# EAGLE design controller_rev1.1(flat) (EAGLE 8.6.3)

## Sheet 1 of 3
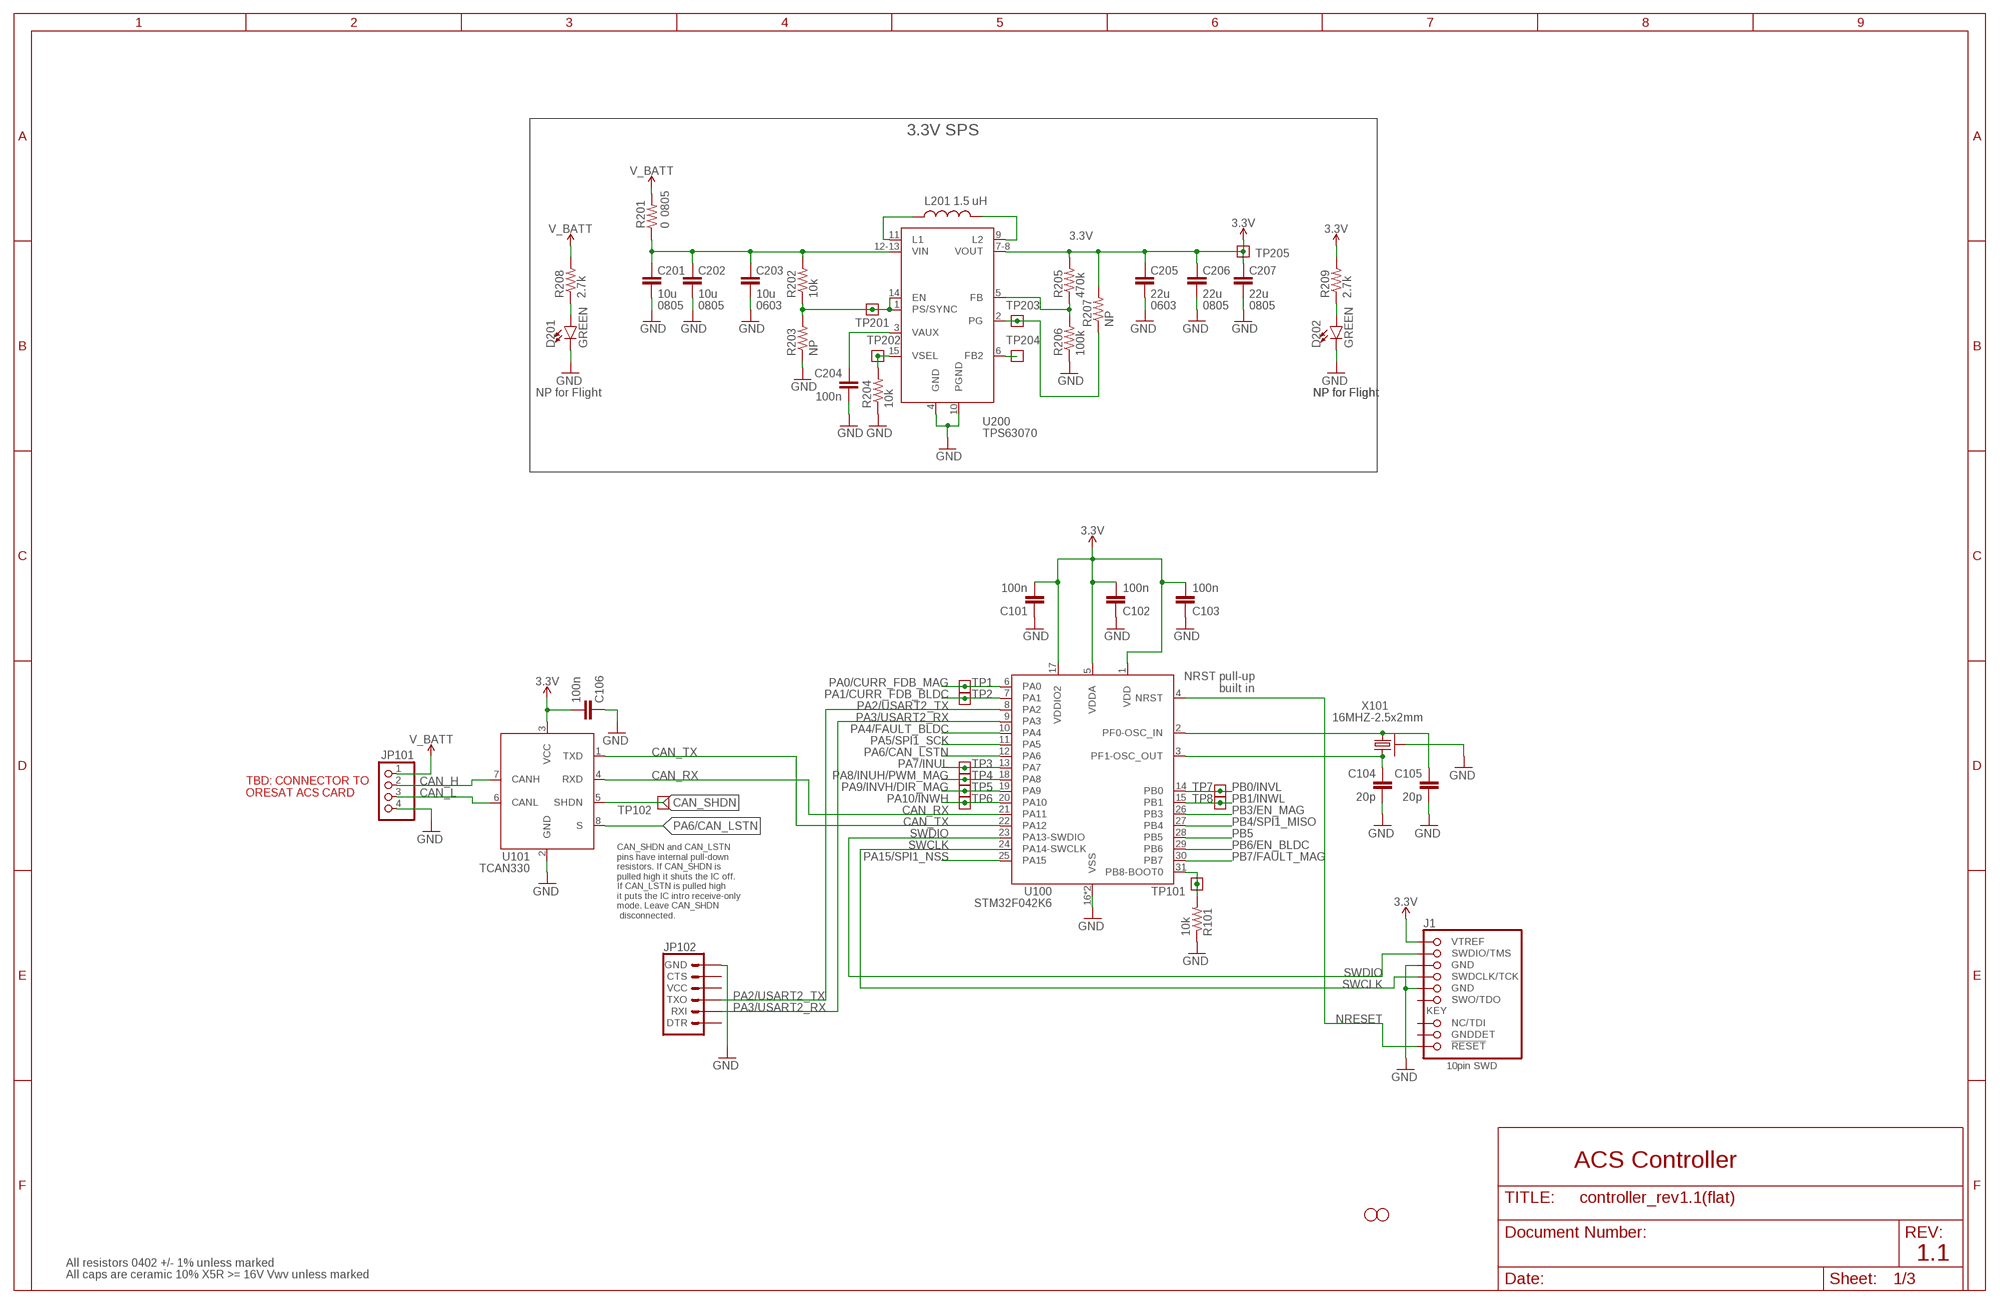
[diagram p0: schematic, sheet 1]

### Parts
C101  100n  C-EU0402-B-NOSILK  [.0402-B-NOSILK]
C102  100n  C-EU0402-B-NOSILK  [.0402-B-NOSILK]
C103  100n  C-EU0402-B-NOSILK  [.0402-B-NOSILK]
C104  20p  C-EU0402-B-NOSILK  [.0402-B-NOSILK]
C105  20p  C-EU0402-B-NOSILK  [.0402-B-NOSILK]
C106  100n  C-EU0402-B-NOSILK  [.0402-B-NOSILK]
C201  10u  C-EU0805-B-NOSILK  [.0805-B-NOSILK]
C202  10u  C-EU0805-B-NOSILK  [.0805-B-NOSILK]
C203  10u  C-EU0603-B-NOSILK  [.0603-B-NOSILK]
C204  100n  C-EU0402-B-NOSILK  [.0402-B-NOSILK]
C205  22u  C-EU0603-B-NOSILK  [.0603-B-NOSILK]
C206  22u  C-EU0805-B-NOSILK  [.0805-B-NOSILK]
C207  22u  C-EU0805-B-NOSILK  [.0805-B-NOSILK]
D201  GREEN  LED-GREEN0603  [LED-0603]
D202  GREEN  LED-GREEN0603  [LED-0603]
H1  STAND-OFFTIGHT  [STAND-OFF-TIGHT]
H2  STAND-OFFTIGHT  [STAND-OFF-TIGHT]
J1  1.27MM-SWD-CONNECTOR  [1.27MM_2X5]
JP101  PINHD-1X4  [1X04]
JP102  6_PIN_SERIAL_TARGETSILK  [6_PIN_SERIAL_TARGET_SIDE_W_SILK]
L201  1.5 uH  L-COILCRAFT-XFL4020  [L-COILCRAFT-XFL4020]
R101  10k  R-US_0402-B-NOSILK  [.0402-B-NOSILK]
R201  0  R-US_0805-B-NOSILK  [.0805-B-NOSILK]
R202  10k  R-US_0402-B-NOSILK  [.0402-B-NOSILK]
R203  NP  R-US_0402-B-NOSILK  [.0402-B-NOSILK]
R204  10k  R-US_0402-B-NOSILK  [.0402-B-NOSILK]
R205  470k  R-US_0402-B-NOSILK  [.0402-B-NOSILK]
R206  100k  R-US_0402-B-NOSILK  [.0402-B-NOSILK]
R207  NP  R-US_0402-B-NOSILK  [.0402-B-NOSILK]
R208  2.7k  R-US_0402-B-NOSILK  [.0402-B-NOSILK]
R209  2.7k  R-US_0402-B-NOSILK  [.0402-B-NOSILK]
TP1  TEST-POINT  [2MM-TEST-POINT]
TP2  TEST-POINT  [2MM-TEST-POINT]
TP3  TEST-POINT  [2MM-TEST-POINT]
TP4  TEST-POINT  [2MM-TEST-POINT]
TP5  TEST-POINT  [2MM-TEST-POINT]
TP6  TEST-POINT  [2MM-TEST-POINT]
TP7  TEST-POINT  [2MM-TEST-POINT]
TP8  TEST-POINT  [2MM-TEST-POINT]
TP101  TEST-POINT  [2MM-TEST-POINT]
TP102  TEST-POINT  [2MM-TEST-POINT]
TP201  TEST-POINT  [2MM-TEST-POINT]
TP202  TEST-POINT  [2MM-TEST-POINT]
TP203  TEST-POINT  [2MM-TEST-POINT]
TP204  TEST-POINT  [2MM-TEST-POINT]
TP205  TEST-POINT  [2MM-TEST-POINT]
U100  STM32F042K6  [QFP32-7X7]
U101  TCAN330  [SOT23-8_TI-DCN]
U200  TPS63070  TPS63070X  [TPS63070X]
X101  16MHZ-2.5x2mm  CRYSTAL-WITH-GND  [CRYSTAL_2.5X2]

### Nets
3.3V: C101.2 C102.2 C103.2 C106.2 C205.1 C206.1 C207.1 J1.VTREF R205.2 R207.2 R209.2 TP205.1 U100.1(VDD) U100.5(VDDA) U100.17(VDDIO2) U101.3(VCC) U200.7-8(VOUT) ; also sheet 2,3
BOOT: R101.2 TP101.1 U100.31(PB8-BOOT0)
CAN_H: JP101.2 U101.7(CANH)
CAN_L: JP101.3 U101.6(CANL)
CAN_RX: U100.21(PA11) U101.4(RXD)
CAN_SHDN: TP102.1 U101.5(SHDN)
CAN_TX: U100.22(PA12) U101.1(TXD)
CRYSTALIN: C105.1 U100.2(PF0-OSC_IN) X101.1
CRYSTALOUT: C104.1 U100.3(PF1-OSC_OUT) X101.3
GND: C101.1 C102.1 C103.1 C104.2 C105.2 C106.1 C201.2 C202.2 C203.2 C204.2 C205.2 C206.2 C207.2 D201.C D202.C J1.GND J1.GND@2(GND) JP101.4 JP102.P$6(GND) R101.1 R203.1 R204.1 R206.1 U100.16(VSS) U100.32(VSS) U101.2(GND) U200.4(GND) U200.10(PGND) X101.2(SHIELD) X101.4(SHIELD) ; also sheet 2,3
N$270: D201.A R208.1
N$271: D202.A R209.1
NRESET: J1.!RESET U100.4(NRST)
PA0/CURR_FDB_MAG: TP1.1 U100.6(PA0) ; also sheet 3
PA1/CURR_FDB_BLDC: TP2.1 U100.7(PA1) ; also sheet 2
PA2/USART2_TX: JP102.P$2(TXO) U100.8(PA2)
PA3/USART2_RX: JP102.P$3(RXI) U100.9(PA3)
PA4/FAULT_BLDC: U100.10(PA4) ; also sheet 2
PA5/SPI1_SCK: U100.11(PA5) ; also sheet 2
PA6/CAN_LSTN: U100.12(PA6) U101.8(S)
PA7/INUL: TP3.1 U100.13(PA7) ; also sheet 2
PA8/INUH/PWM_MAG: TP4.1 U100.18(PA8) ; also sheet 2,3
PA9/INVH/DIR_MAG: TP5.1 U100.19(PA9) ; also sheet 2,3
PA10/INWH: TP6.1 U100.20(PA10) ; also sheet 2
PA15/SPI1_NSS: U100.25(PA15) ; also sheet 2
PB0/INVL: TP7.1 U100.14(PB0) ; also sheet 2
PB1/INWL: TP8.1 U100.15(PB1) ; also sheet 2
PB3/EN_MAG: U100.26(PB3) ; also sheet 3
PB4/SPI1_MISO: U100.27(PB4) ; also sheet 2
PB5: U100.28(PB5)
PB6/EN_BLDC: U100.29(PB6) ; also sheet 2
PB7/FAULT_MAG: U100.30(PB7) ; also sheet 3
SWCLK: J1.SWDCLK(SWDCLK/TCK) U100.24(PA14-SWCLK)
SWDIO: J1.SWDIO(SWDIO/TMS) U100.23(PA13-SWDIO)
TPS-EN: R202.1 R203.2 TP201.1 U200.1(PS/SYNC) U200.14(EN)
TPS-FB: R205.1 R206.2 U200.5(FB)
TPS-FB2: TP204.1 U200.6(FB2)
TPS-L1: L201.1 U200.11(L1)
TPS-L2: L201.2 U200.9(L2)
TPS-PG: R207.1 TP203.1 U200.2(PG)
TPS-VAUX: C204.1 U200.3(VAUX)
TPS-VIN: C201.1 C202.1 C203.1 R201.1 R202.2 U200.12-13(VIN)
TPS-VSEL: R204.2 TP202.1 U200.15(VSEL)
V_BATT: JP101.1 R201.2 R208.2 ; also sheet 2,3
Unconnected: J1.GNDDET J1.NC(NC/TDI) J1.SWO(SWO/TDO) JP102.P$1(DTR) JP102.P$4(VCC) JP102.P$5(CTS)

### Notes on the sheet
- 3.3V SPS
- 0805
- 0805 | 0805 | 0603 | 0603 | 0805 | 0805
- NP for Flight | NP for Flight | NP for Flight
- NRST pull-up
  built in
- TBD: CONNECTOR TO 
  ORESAT ACS CARD
- CAN_SHDN and CAN_LSTN
  pins have internal pull-down
  resistors. If CAN_SHDN is 
  pulled high it shuts the IC off.
  If CAN_LSTN is pulled high
  it puts the IC intro receive-only
  mode. Leave CAN_SHDN
   disconnected.
- ACS Controller
- 1.1
- All resistors 0402 +/- 1% unless marked
- All caps are ceramic 10% X5R >= 16V Vwv unless marked

## Sheet 2 of 3
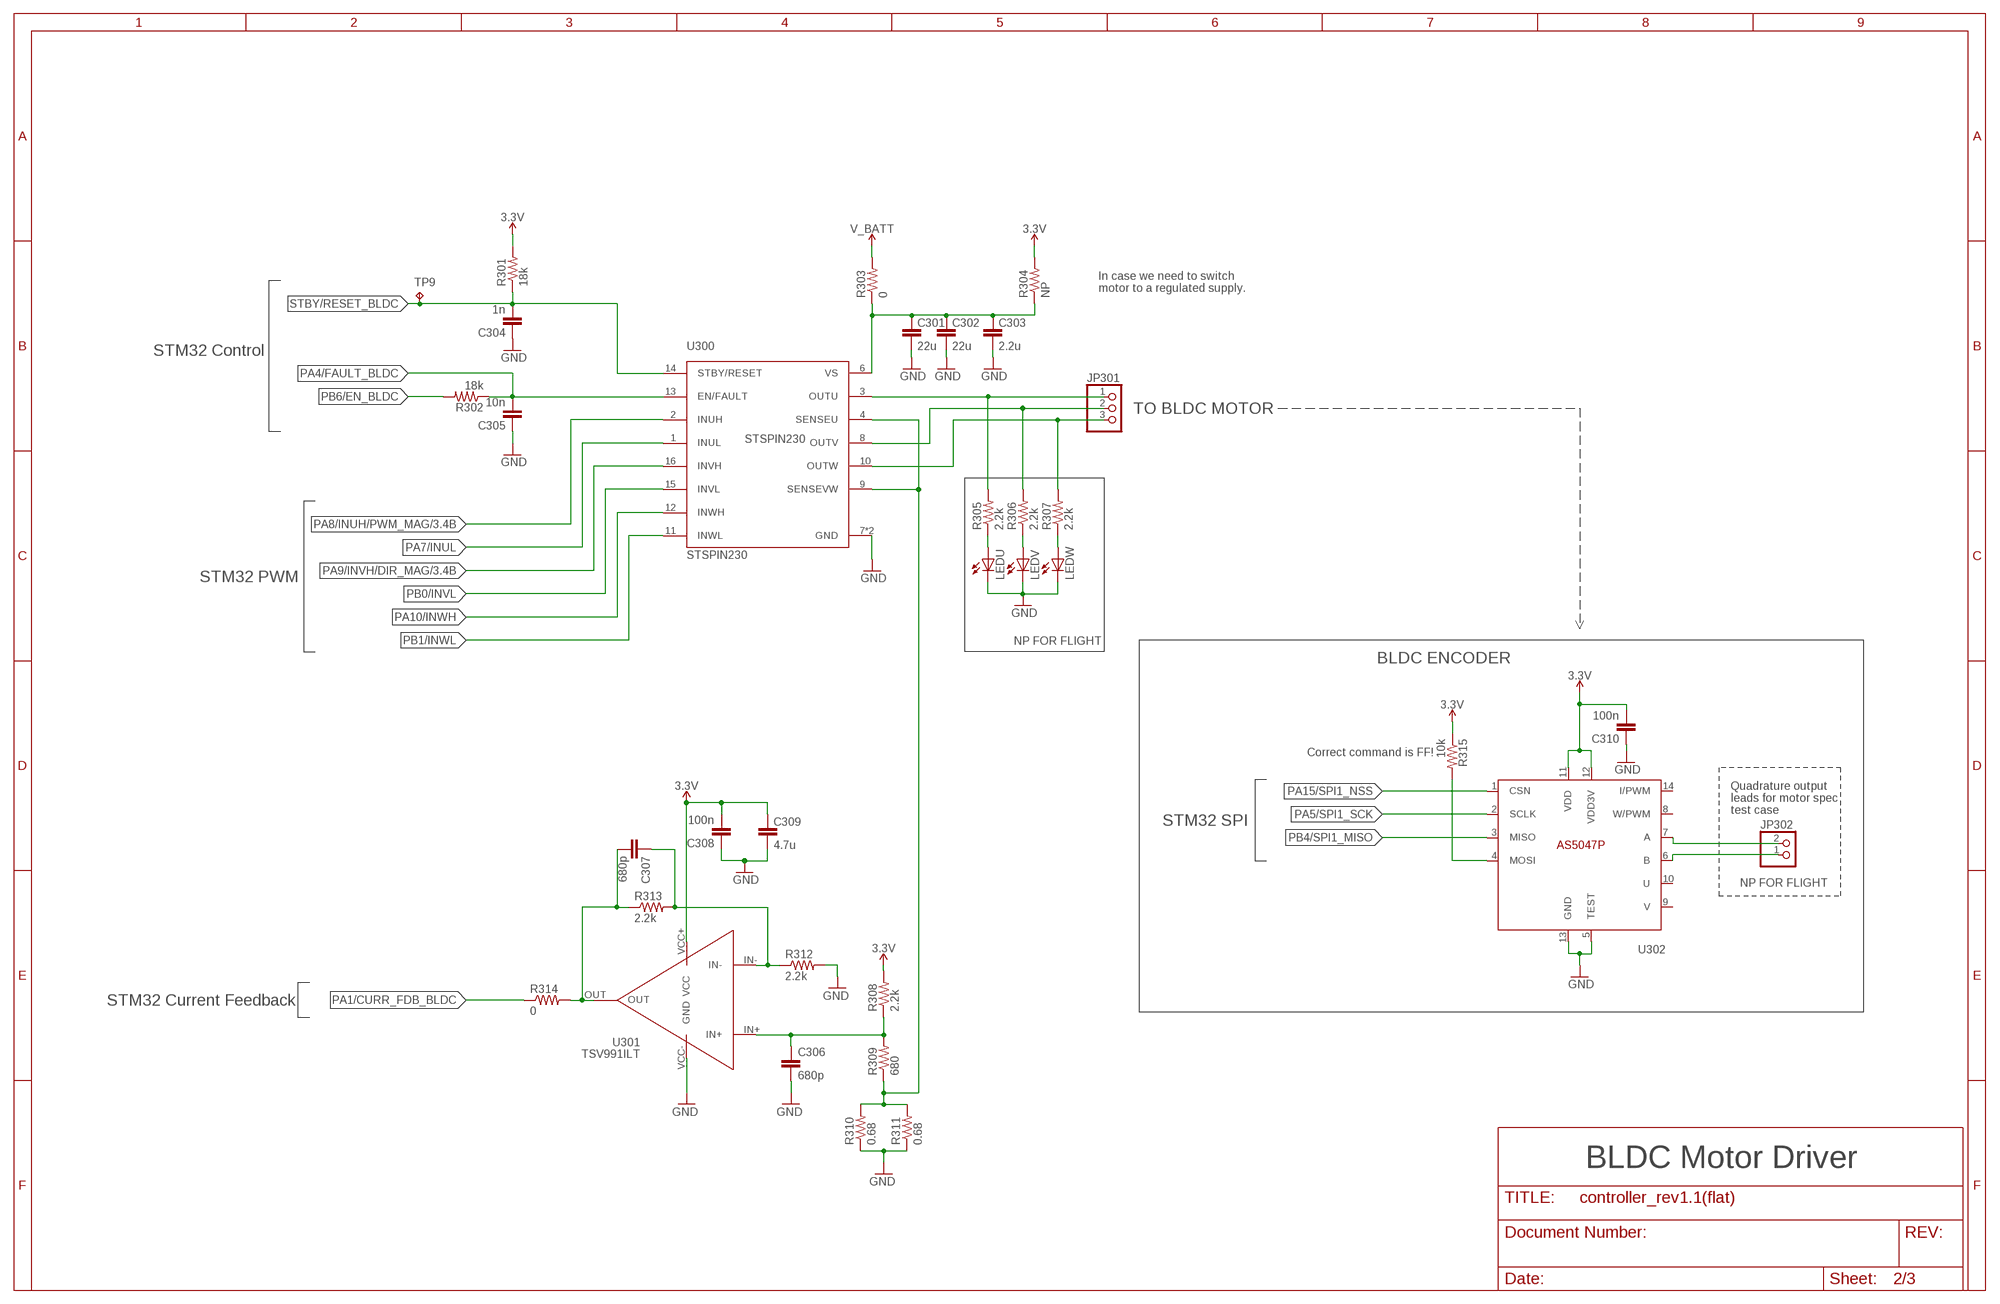
[diagram p1: schematic, sheet 2]

### Parts
C301  22u  C-EU0603-B-NOSILK  [.0603-B-NOSILK]
C302  22u  C-EU0603-B-NOSILK  [.0603-B-NOSILK]
C303  2.2u  C-EU0603-B-NOSILK  [.0603-B-NOSILK]
C304  1n  C-EU0402-B-NOSILK  [.0402-B-NOSILK]
C305  10n  C-EU0402-B-NOSILK  [.0402-B-NOSILK]
C306  680p  C-EU0402-B-NOSILK  [.0402-B-NOSILK]
C307  680p  C-EU0402-B-NOSILK  [.0402-B-NOSILK]
C308  100n  C-EU0402-B-NOSILK  [.0402-B-NOSILK]
C309  4.7u  C-EU0603-B-NOSILK  [.0603-B-NOSILK]
C310  100n  C-EU0402-B-NOSILK  [.0402-B-NOSILK]
JP301  PINHD-1X3  [1X03]
JP302  PINHD-1X2/90  [1X02/90]
LEDU  LEDCHIP-LED0603  [CHIP-LED0603]
LEDV  LEDCHIP-LED0603  [CHIP-LED0603]
LEDW  LEDCHIP-LED0603  [CHIP-LED0603]
R301  18k  R-US_0402-B-NOSILK  [.0402-B-NOSILK]
R302  18k  R-US_0402-B-NOSILK  [.0402-B-NOSILK]
R303  0  R-US_0805-B-NOSILK  [.0805-B-NOSILK]
R304  NP  R-US_0805-B-NOSILK  [.0805-B-NOSILK]
R305  2.2k  R-US_0805-B-NOSILK  [.0805-B-NOSILK]
R306  2.2k  R-US_0805-B-NOSILK  [.0805-B-NOSILK]
R307  2.2k  R-US_0805-B-NOSILK  [.0805-B-NOSILK]
R308  2.2k  R-US_0402-B-NOSILK  [.0402-B-NOSILK]
R309  680  R-US_0402-B-NOSILK  [.0402-B-NOSILK]
R310  0.68  R-US_0805-B-NOSILK  [.0805-B-NOSILK]
R311  0.68  R-US_0805-B-NOSILK  [.0805-B-NOSILK]
R312  2.2k  R-US_0402-B-NOSILK  [.0402-B-NOSILK]
R313  2.2k  R-US_0402-B-NOSILK  [.0402-B-NOSILK]
R314  0  R-US_0402-B-NOSILK  [.0402-B-NOSILK]
R315  10k  R-US_0402-B-NOSILK  [.0402-B-NOSILK]
TP9  TPPAD1-13  [P1-13]
U300  STSPIN230  [VFQFPN]
U301  TSV991ILT  [SOT23-5]
U302  AS5047P  [TSSOP14]

### Nets
3.3V: C308.2 C309.1 C310.2 R301.2 R304.2 R308.2 R315.1 U301.VCC+(VCC) U302.11(VDD) U302.12(VDD3V) ; also sheet 1,3
GND: C301.2 C302.2 C303.2 C304.1 C305.1 C306.2 C308.1 C309.2 C310.1 LEDU.C LEDV.C LEDW.C R310.1 R311.1 R312.2 U300.7(GND) U300.EPAD(GND) U301.VCC-(GND) U302.5(TEST) U302.13(GND) ; also sheet 1,3
N$1: R315.2 U302.4(MOSI)
N$4: JP302.2 U302.7(A)
N$6: LEDU.A R305.1
N$10: LEDV.A R306.1
N$11: LEDW.A R307.1
N$12: C301.1 C302.1 C303.1 R303.1 R304.1 U300.6(VS)
N$13: JP302.1 U302.6(B)
N$14: C307.1 R312.1 R313.2 U301.IN-
N$16: C306.1 R308.1 R309.2 U301.IN+
N$29: C307.2 R313.1 R314.2 U301.OUT
PA1/CURR_FDB_BLDC: R314.1 ; also sheet 1
PA4/FAULT_BLDC: C305.2 R302.1 U300.13(EN/FAULT) ; also sheet 1
PA5/SPI1_SCK: U302.2(SCLK) ; also sheet 1
PA7/INUL: U300.1(INUL) ; also sheet 1
PA8/INUH/PWM_MAG: U300.2(INUH) ; also sheet 1,3
PA9/INVH/DIR_MAG: U300.16(INVH) ; also sheet 1,3
PA10/INWH: U300.12(INWH) ; also sheet 1
PA15/SPI1_NSS: U302.1(CSN) ; also sheet 1
PB0/INVL: U300.15(INVL) ; also sheet 1
PB1/INWL: U300.11(INWL) ; also sheet 1
PB4/SPI1_MISO: U302.3(MISO) ; also sheet 1
PB6/EN_BLDC: R302.2 ; also sheet 1
SENSE_BLDC: R309.1 R310.2 R311.2 U300.4(SENSEU) U300.9(SENSEVW)
STBY/RESET_BLDC: C304.2 R301.1 TP9.TP U300.14(STBY/RESET)
U: JP301.1 R305.2 U300.3(OUTU)
V: JP301.2 R306.2 U300.8(OUTV)
V_BATT: R303.2 ; also sheet 1,3
W: JP301.3 R307.2 U300.10(OUTW)
Unconnected: U302.8(W/PWM) U302.9(V) U302.10(U) U302.14(I/PWM)

### Notes on the sheet
- In case we need to switch 
  motor to a regulated supply.
- STM32 Control
- TO BLDC MOTOR
- STM32 PWM
- NP FOR FLIGHT
- BLDC ENCODER
- Correct command is FF!
- Quadrature output
  leads for motor spec
  test case
- STM32 SPI
- NP FOR FLIGHT
- STM32 Current Feedback
- BLDC Motor Driver

## Sheet 3 of 3
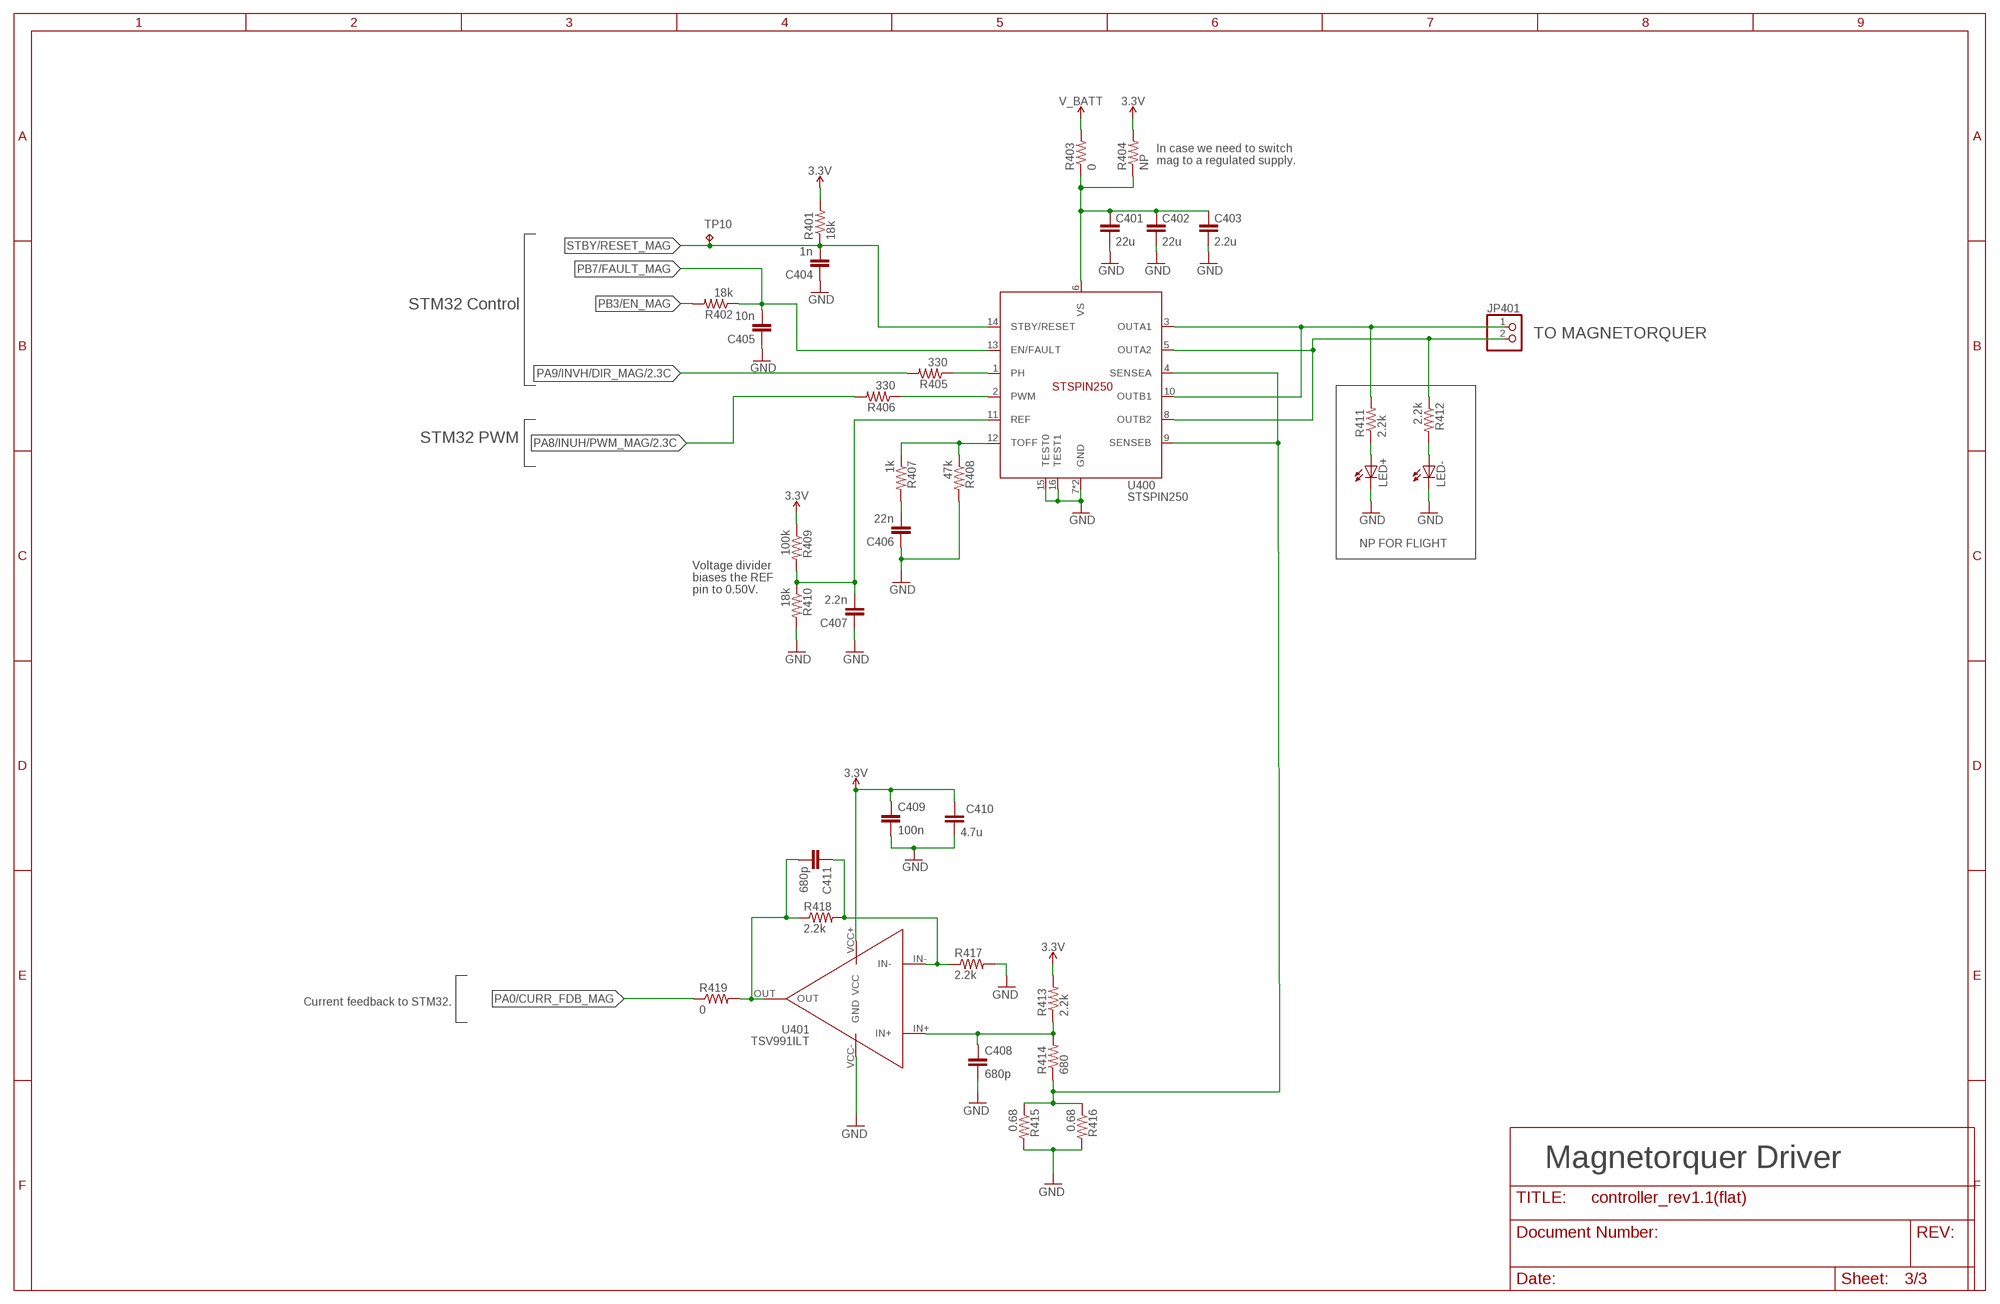
[diagram p2: schematic, sheet 3]

### Parts
C401  22u  C-EU0603-B-NOSILK  [.0603-B-NOSILK]
C402  22u  C-EU0603-B-NOSILK  [.0603-B-NOSILK]
C403  2.2u  C-EU0603-B-NOSILK  [.0603-B-NOSILK]
C404  1n  C-EU0402-B-NOSILK  [.0402-B-NOSILK]
C405  10n  C-EU0402-B-NOSILK  [.0402-B-NOSILK]
C406  22n  C-EU0402-B-NOSILK  [.0402-B-NOSILK]
C407  2.2n  C-EU0402-B-NOSILK  [.0402-B-NOSILK]
C408  680p  C-EU0402-B-NOSILK  [.0402-B-NOSILK]
C409  100n  C-EU0402-B-NOSILK  [.0402-B-NOSILK]
C410  4.7u  C-EU0603-B-NOSILK  [.0603-B-NOSILK]
C411  680p  C-EU0402-B-NOSILK  [.0402-B-NOSILK]
JP401  PINHD-1X2  [1X02]
LED+  LEDCHIP-LED0603  [CHIP-LED0603]
LED-  LEDCHIP-LED0603  [CHIP-LED0603]
R401  18k  R-US_0402-B-NOSILK  [.0402-B-NOSILK]
R402  18k  R-US_0402-B-NOSILK  [.0402-B-NOSILK]
R403  0  R-US_0805-B-NOSILK  [.0805-B-NOSILK]
R404  NP  R-US_0805-B-NOSILK  [.0805-B-NOSILK]
R405  330  R-US_0402-B-NOSILK  [.0402-B-NOSILK]
R406  330  R-US_0402-B-NOSILK  [.0402-B-NOSILK]
R407  1k  R-US_0402-B-NOSILK  [.0402-B-NOSILK]
R408  47k  R-US_0402-B-NOSILK  [.0402-B-NOSILK]
R409  100k  R-US_0402-B-NOSILK  [.0402-B-NOSILK]
R410  18k  R-US_0402-B-NOSILK  [.0402-B-NOSILK]
R411  2.2k  R-US_0805-B-NOSILK  [.0805-B-NOSILK]
R412  2.2k  R-US_0805-B-NOSILK  [.0805-B-NOSILK]
R413  2.2k  R-US_0402-B-NOSILK  [.0402-B-NOSILK]
R414  680  R-US_0402-B-NOSILK  [.0402-B-NOSILK]
R415  0.68  R-US_0805-B-NOSILK  [.0805-B-NOSILK]
R416  0.68  R-US_0805-B-NOSILK  [.0805-B-NOSILK]
R417  2.2k  R-US_0402-B-NOSILK  [.0402-B-NOSILK]
R418  2.2k  R-US_0402-B-NOSILK  [.0402-B-NOSILK]
R419  0  R-US_0402-B-NOSILK  [.0402-B-NOSILK]
TP10  TPPAD1-13  [P1-13]
U400  STSPIN250  [VFQPN]
U401  TSV991ILT  [SOT23-5]

### Nets
3.3V: C409.1 C410.1 R401.2 R404.2 R409.1 R413.2 U401.VCC+(VCC) ; also sheet 1,2
GND: C401.2 C402.2 C403.2 C404.1 C405.1 C406.1 C407.1 C408.2 C409.2 C410.2 LED+.C LED-.C R408.2 R410.2 R415.2 R416.2 R417.2 U400.7(GND) U400.15(TEST0) U400.16(TEST1) U400.EPAD(GND) U401.VCC-(GND) ; also sheet 1,2
N$2: C406.2 R407.2
N$3: R406.1 U400.2(PWM)
N$5: R405.1 U400.1(PH)
N$15: C408.1 R413.1 R414.2 U401.IN+
N$17: C411.1 R417.1 R418.2 U401.IN-
N$19: R407.1 R408.1 U400.12(TOFF)
N$20: C401.1 C402.1 C403.1 R403.1 R404.1 U400.6(VS)
N$22: LED+.A R411.1
N$23: LED-.A R412.2
N$25: C407.2 R409.2 R410.1 U400.11(REF)
N$27: C411.2 R418.1 R419.2 U401.OUT
OUT1: JP401.1 R411.2 U400.3(OUTA1) U400.10(OUTB1)
OUT2: JP401.2 R412.1 U400.5(OUTA2) U400.8(OUTB2)
PA0/CURR_FDB_MAG: R419.1 ; also sheet 1
PA8/INUH/PWM_MAG: R406.2 ; also sheet 1,2
PA9/INVH/DIR_MAG: R405.2 ; also sheet 1,2
PB3/EN_MAG: R402.2 ; also sheet 1
PB7/FAULT_MAG: C405.2 R402.1 U400.13(EN/FAULT) ; also sheet 1
SENSE_MAG: R414.1 R415.1 R416.1 U400.4(SENSEA) U400.9(SENSEB)
STBY/RESET_MAG: C404.2 R401.1 TP10.TP U400.14(STBY/RESET)
V_BATT: R403.2 ; also sheet 1,2

### Notes on the sheet
- In case we need to switch 
  mag to a regulated supply.
- STM32 Control
- TO MAGNETORQUER
- STM32 PWM
- NP FOR FLIGHT
- Voltage divider
  biases the REF
  pin to 0.50V.
- Current feedback to STM32.
- Magnetorquer Driver

## Library data of the parts
C101-C103 C106 C204 C304-C308 C310 C404-C409 C411 = rcl_custom:C-EU: CAPACITOR, European symbol; DIS: Digi-Key; DPN: 1276-1001-1-ND; MFR: Samsung; MPN: CL05B104KO5NNNC
C104 C105 = rcl_custom:C-EU: CAPACITOR, European symbol; DIS: Digi-Key; DPN: 1276-6601-1-ND; MFR: Samsung; MPN: CL05C200JB51PNC
C201 C202 C206 C207 = oresat-rcl:C-EU: CAPACITOR, European symbol
C203 C205 C301-C303 C309 C401-C403 C410 = oresat-rcl:C-EU: CAPACITOR, European symbol; DIS: Digi-Key; DPN: 1276-1001-1-ND; MFR: Samsung; MPN: CL05B104KO5NNNC
D201 D202 = SparkFun-LED:LED-GREEN: Green SMD LED Used in manufacturing of various products at SparkFun Packages: 0603 - SMD 0603 package [Product Link] <http://www.futureelectronics.com/en/technologies/semiconductors/optoelectronics/leds/Pages/9894312-LTST-C190GKT.aspx?CrossPart=HSMG-C190&IM=0> LilyPad 1206 - SMD1206 LilyPad package [Product Link] <http://www.futureelectronics.com/en/Technologies/Product.aspx?ProductID=IN150NGHARVATEKCORPORATION2049943&IM=0> 1206 - SMD1206 package [Product Link] <http://www.futureelectronics.com/en/technologies/semiconductors/optoelectronics/leds/Pages/8315665-LTST-C150KGKT.aspx?IM=0> 1206 Bottom Mount -SMD 1206 Bottom Mount [Product Link] <http://www.digikey.com/product-detail/en/lite-on-inc/LTST-C230KGKT/160-1456-1-ND/386854> SparkFun Products: Pro Mini 328 -5V <https://www.sparkfun.com/products/821> RedBoard <https://www.sparkfun.com/products/12757> MP3 Trigger <https://www.sparkfun.com/products/13720> Makey Makey <https://www.sparkfun.com/products/11076>; PROD_ID: DIO-00821
H1 H2 = SparkFun-Hardware:STAND-OFF: Stand Off Drill holes for mechanically mounting via screws, standoffs, etc. Note: Use the keepout ring to avoid running the screw head into surrounding components. Variant Overviews STAND-OFF - Mechanical footprint for a #4 phillips button head screw. STAND-OFF-TIGHT - Mechanical footprint for a #4 phillips button head screw, Example SparkFun Products Screw - Phillips Head (1/4", 4-40, 10 pack) <https://www.sparkfun.com/products/10453> (PRT-10453) Screw - Phillips Head (1/2", 4-40, 10 pack) <https://www.sparkfun.com/products/10452> (PRT-10452) Screw - Phillips Head (3/4", 4-40, 10 pack) <https://www.sparkfun.com/products/10451> (PRT-10451) Screw - Phillips Head (1", 4-40, 10 pack) <https://www.sparkfun.com/products/10450> (PRT-10450)
J1 = J-CNC-3220-10-0100-00-ARM-SWD-port:1.27MM-SWD-CONNECTOR: ARM SWD Programming Header. Example part is the CNC 3220-10-0100-00
JP101 = pinhead:PINHD-1X4: PIN HEADER
JP102 = SparkFun-Connectors:6_PIN_SERIAL_TARGET: 6-pin header connection for use with the "FTDI BASIC" pinout - TARGET SIDE. Also known as "Arduino Serial Program Header". It is used to mate with our FTDI Basic serial programmers using the Arduino IDE. Note, this device has "TARGET" in the name. It is intended to be used on a design that contains a target micro-controller that you wish to program. The "sister" device, named "CABLE" is inteneded to be used on a design that usually lives on the end of your USB cable and prvides the converter chip (FTDI232 or FTDI231x) to commnicate serial RX/TX. You can populate with some of these: Break Away Headers - Straight <https://www.sparkfun.com/products/116> (PRT-00116) For reference (or to suit your programming needs) check out these designs: SparkFun FTDI Basic Breakout - 5V <https://www.sparkfun.com/products/9716> (DEV-09716) SparkFun FTDI Basic Breakout - 3.3V <https://www.sparkfun.com/products/9873> (DEV-09873) SparkFun FTDI SmartBasic <https://www.sparkfun.com/products/12935> (DEV-12935) SparkFun Beefy 3 - FTDI Basic Breakout <https://www.sparkfun.com/products/13746> (DEV-13746)
JP301 = pinhead:PINHD-1X3: PIN HEADER
JP302 JP401 = pinhead:PINHD-1X2: PIN HEADER
L201 = L-Coilcraft-XFL4020:L-COILCRAFT-XFL4020; DIS: Mouser; DPN: 994-XFL4020-152MEB; MFR: Coilcraft; MPN: XFL4020-152ME
LED+ LED- LEDU LEDV LEDW = adafruit:LED: LED OSRAM: - CHIPLED LG R971, LG N971, LY N971, LG Q971, LY Q971, LO R971, LY R971 LH N974, LH R974 LS Q976, LO Q976, LY Q976 LO Q996 - Hyper CHIPLED LW Q18S LB Q993, LB Q99A, LB R99A - SideLED LS A670, LO A670, LY A670, LG A670, LP A670 LB A673, LV A673, LT A673, LW A673 LH A674 LY A675 LS A676, LA A676, LO A676, LY A676, LW A676 LS A679, LY A679, LG A679 - Hyper Micro SIDELED® LS Y876, LA Y876, LO Y876, LY Y876 LT Y87S - SmartLED LW L88C, LW L88S LB L89C, LB L89S, LG L890 LS L89K, LO L89K, LY L89K LS L896, LA L896, LO L896, LY L896 - TOPLED LS T670, LO T670, LY T670, LG T670, LP T670 LSG T670, LSP T670, LSY T670, LOP T670, LYG T670 LG T671, LOG T671, LSG T671 LB T673, LV T673, LT T673, LW T673 LH T674 LS T676, LA T676, LO T676, LY T676, LB T676, LH T676, LSB T676, LW T676 LB T67C, LV T67C, LT T67C, LS T67K, LO T67K, LY T67K, LW E67C LS E67B, LA E67B, LO E67B, LY E67B, LB E67C, LV E67C, LT E67C LW T67C LS T679, LY T679, LG T679 LS T770, LO T770, LY T770, LG T770, LP T770 LB T773, LV T773, LT T773, LW T773 LH T774 LS E675, LA E675, LY E675, LS T675 LS T776, LA T776, LO T776, LY T776, LB T776 LHGB T686 LT T68C, LB T68C - Hyper Mini TOPLED® LB M676 - Mini TOPLED Santana® LG M470 LS M47K, LO M47K, LY M47K Source: http://www.osram.convergy.de/
R101 R202-R209 R301 R302 R308 R309 R312-R315 R401 R402 R405-R410 R413 R414 R417-R419 = rcl_custom:R-US_: RESISTOR, American symbol; DIS: Digi-Key; DPN: 1276-4275-1-ND; MFR: Samsung; MPN: RC1005F6653CS
R201 = rcl_custom:R-US_: RESISTOR, American symbol; DIS: Digi-Key; DPN: RHM0.0ARCT-ND; MFR: Rohm; MPN: MCR10EZPJ000
R303-R307 R310 R311 R403 R404 R411 R412 R415 R416 = oresat-rcl:R-US_: RESISTOR, American symbol
TP1-TP8 TP101 TP102 TP201-TP205 = Tova:TEST-POINT
TP9 TP10 = testpad:TP: Test pad
U100 = STM32F042K:STM32F042K6; DIS: Digi-Key; DPN: STM32F042K6T7-ND; MFR: STMicroelectronics; MPN: STM32F042K6T7
U101 = TCAN330:TCAN330; DIS: Digi-Key; DPN: 296-44211-1-ND; MFR: Texas Instruments; MPN: TCAN330GDCNT
U200 = ic-pwr-tps63070x:TPS63070X: TPS63070 2-V to 16-V Buck-Boost Converter With 3.6-A Switch Current
U300 = U-ST-STSPIN230-BLDC-controller:STSPIN230
U301 U401 = TSV991ILT:TSV991ILT
U302 = U-AMS-AS5047P-encoder:AS5047P
U400 = U-ST-STSPIN250-Brushed-DC-controller:STSPIN250
X101 = low-gain-radio:CRYSTAL-WITH-GND; DIS: Digi-Key; DPN: XC2181CT-ND; MFR: ECS Inc.; MPN: ECS-160-10-36Q-ES-TR

## Board
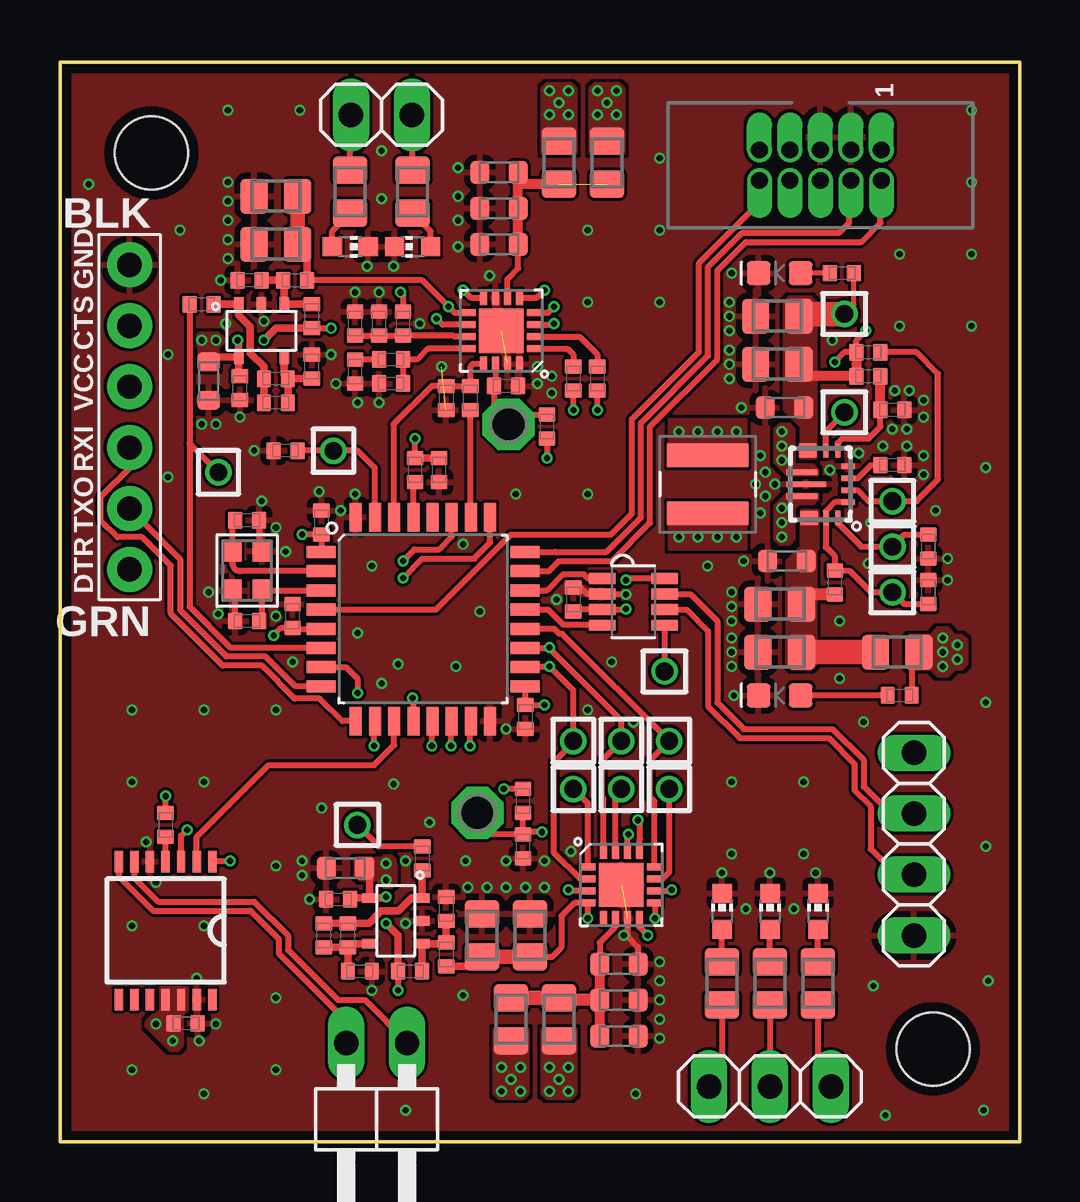
[diagram p3: board, top side]
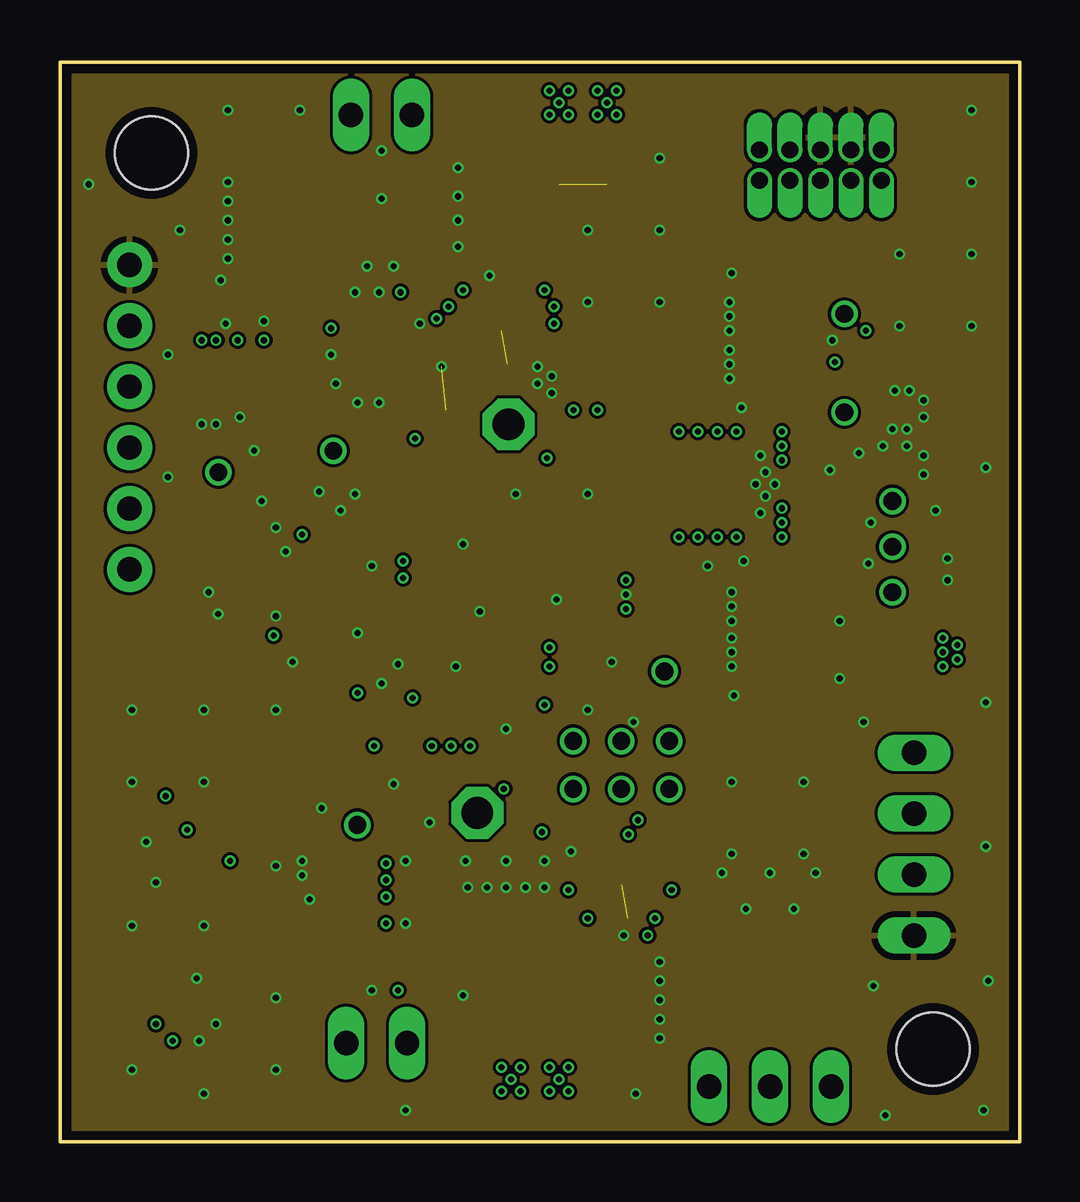
[diagram p4: board, inner layer Route2]
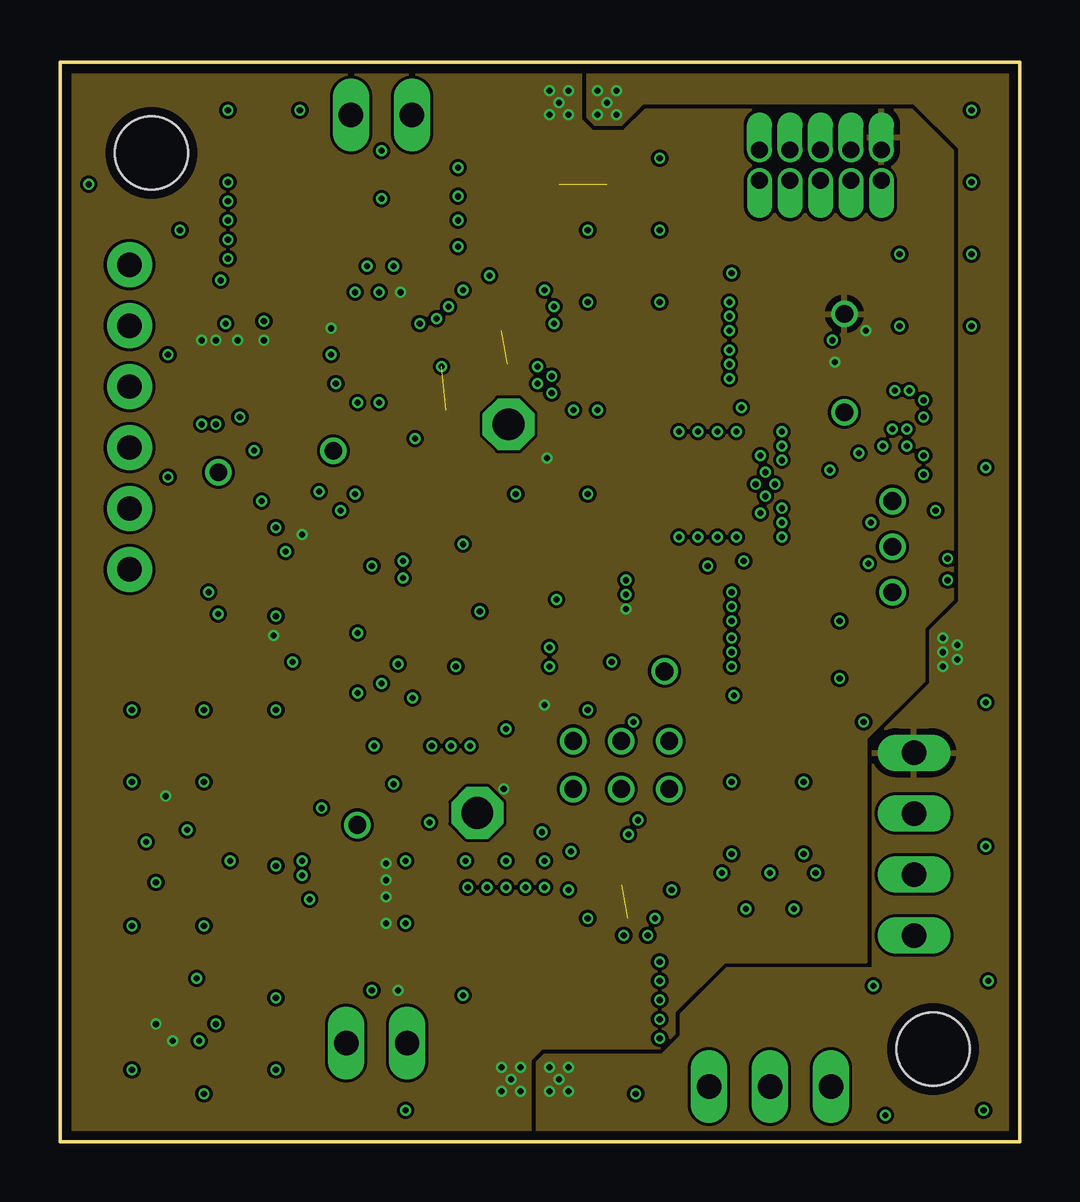
[diagram p5: board, inner layer Route15]
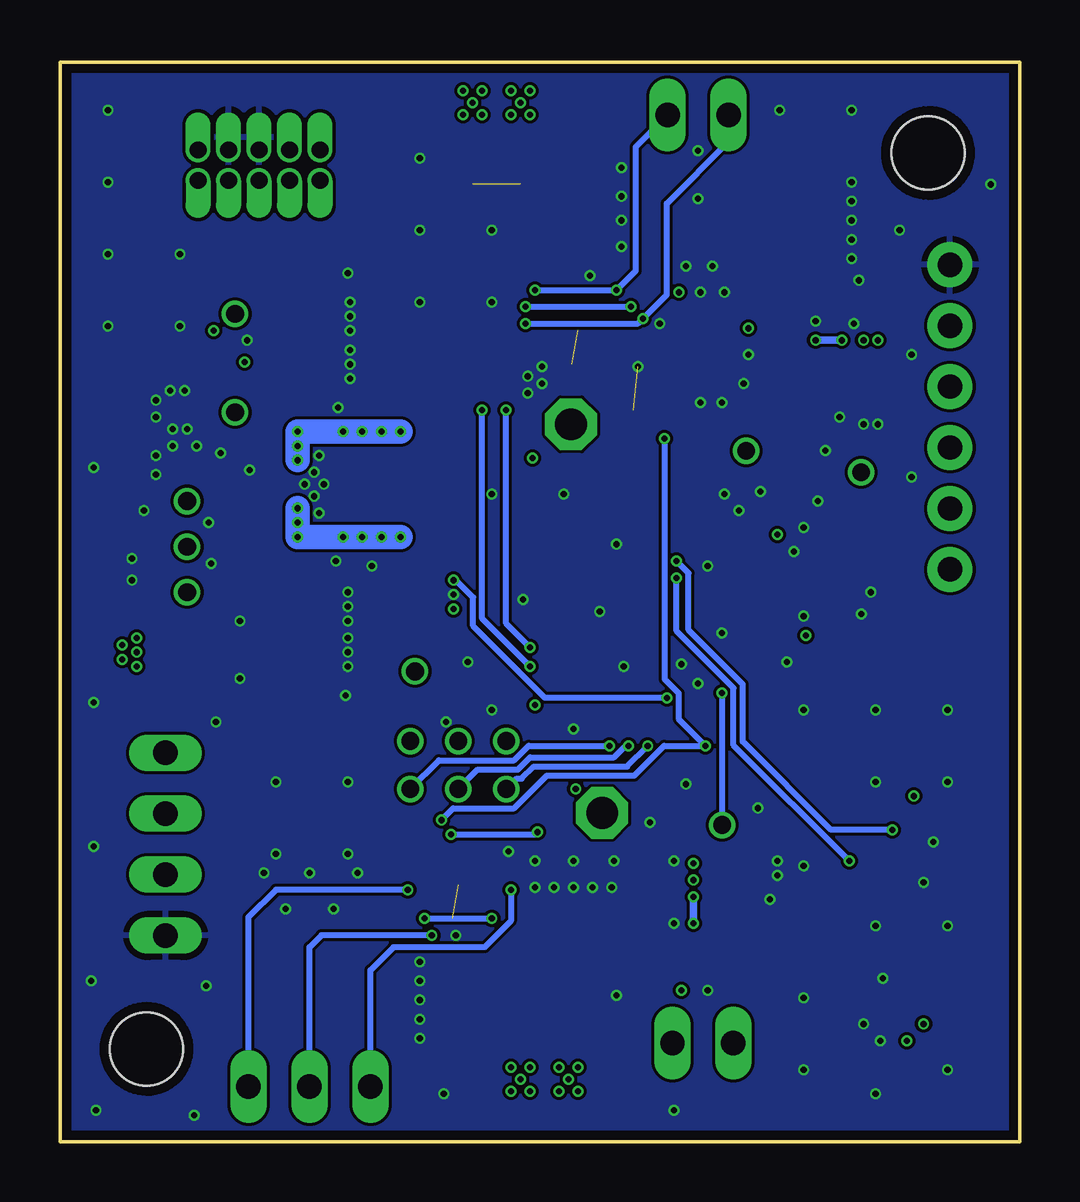
[diagram p6: board, bottom side, seen from below]

Size 40 x 45 mm. Coordinates in mm from the lower left corner, seen from the top.
Outline: 0,0 40,0 40,45 0,45 0,0
Copper layers (1*2*15*16): Top 0.035559375mm / dielectric 0.17018125mm / Route2 0.01778125mm / dielectric 47mil / Route15 0.01778125mm / dielectric 0.17018125mm / Bottom 0.035559375mm
Design rules "oshpark-4layer-tented": minimum track width 5mil, minimum drill 10mil, track to track 5mil, track to pad 5mil, pad to pad 5mil, via to via 5mil, smd to smd 5mil, copper to edge 15mil, drill to drill 6mil, minimum pad ring 4mil, minimum via ring 4mil, stop-mask expansion 2.5mil, vias tented up to drill 20mil, thermal gap 10mil

### Footprints (pad centres in the part's own frame; a part is rotated, then mirrored left to right if it is on the bottom)
.0402-B-NOSILK = smd 0.6 x 0.7: 1 -0.5,0; 2 0.5,0
.0805-B-NOSILK = smd 1.15 x 1.45: 1 -0.9,0; 2 0.9,0
.0603-B-NOSILK = smd 0.8 x 0.95: 1 -0.8,0; 2 0.8,0
LED-0603 = smd 1 x 1: A -0.877,0; C 0.877,0
STAND-OFF-TIGHT = hole 3.048: 0,0
1.27MM_2X5 = drill 0.7 pad 1.016 offset: !RESET 0.635,-2.54; GND -0.635,1.27; GND@2 -0.635,0; GNDDET -0.635,-2.54; KEY -0.635,-1.27; NC 0.635,-1.27; SWDCLK 0.635,1.27; SWDIO 0.635,2.54; SWO 0.635,0; VTREF -0.635,2.54
1X04 = drill 1.016 long: 1 -3.81,0; 2 -1.27,0; 3 1.27,0; 4 3.81,0
6_PIN_SERIAL_TARGET_SIDE_W_SILK = drill 1.016 pad 1.88: P$1 -6.35,0; P$2 -3.81,0; P$3 -1.27,0; P$4 1.27,0; P$5 3.81,0; P$6 6.35,0
1X03 = drill 1.016 long: 1 -2.54,0; 2 0,0; 3 2.54,0
1X02/90 = drill 1.016 long: 1 -1.27,-3.81; 2 1.27,-3.81
1X02 = drill 1.016 long: 1 -1.27,0; 2 1.27,0
L-COILCRAFT-XFL4020 = smd 0.98 x 3.4: 1 -1.2,0; 2 1.2,0
CHIP-LED0603 = smd 0.8 x 0.8: A 0,-0.75; C 0,0.75
2MM-TEST-POINT = drill 0.737: 1 0,0
P1-13 = drill 1.321 pad 2.159 octagon: TP 0,0
QFP32-7X7 = smd 1.2 x 0.5: 1 -4.25,2.8; 2 -4.25,2; 3 -4.25,1.2; 4 -4.25,0.4; 5 -4.25,-0.4; 6 -4.25,-1.2; 7 -4.25,-2; 8 -4.25,-2.8; 17 4.25,-2.8; 18 4.25,-2; 19 4.25,-1.2; 20 4.25,-0.4; 21 4.25,0.4; 22 4.25,1.2; 23 4.25,2; 24 4.25,2.8 | smd 0.5 x 1.2: 9 -2.8,-4.25; 10 -2,-4.25; 11 -1.2,-4.25; 12 -0.4,-4.25; 13 0.4,-4.25; 14 1.2,-4.25; 15 2,-4.25; 16 2.8,-4.25; 25 2.8,4.25; 26 2,4.25; 27 1.2,4.25; 28 0.4,4.25; 29 -0.4,4.25; 30 -1.2,4.25; 31 -2,4.25; 32 -2.8,4.25
SOT23-8_TI-DCN = smd 0.45 x 1.1: 1 -0.975,-1.3; 2 -0.325,-1.3; 3 0.325,-1.3; 4 0.975,-1.3; 5 0.975,1.3; 6 0.325,1.3; 7 -0.325,1.3; 8 -0.975,1.3
TPS63070X = smd 0.6 x 0.25: 1 -1.15,0.75; 2 -1.15,0.25; 3 -1.15,-0.25; 4 -1.15,-0.75 | smd 0.25 x 0.6: 5 -0.725,-1.4; 6 -0.225,-1.4; 14 -0.225,1.4; 15 -0.725,1.4 | smd 0.75 x 0.6: 7-8 0.525,-1.4; 12-13 0.475,1.4 | smd 1.35 x 0.25: 9 0.775,-0.5; 11 0.775,0.5 | smd 1.7 x 0.25: 10 0.6,0
VFQFPN = smd 0.63 x 0.3: 1 -1.39,0.75; 2 -1.39,0.25; 3 -1.39,-0.25; 4 -1.39,-0.75; 9 1.39,-0.75; 10 1.39,-0.25; 11 1.39,0.25; 12 1.39,0.75 | smd 0.3 x 0.63: 5 -0.75,-1.39; 6 -0.25,-1.39; 7 0.25,-1.39; 8 0.75,-1.39; 13 0.75,1.39; 14 0.25,1.39; 15 -0.25,1.39; 16 -0.75,1.39 | smd 1.85 x 1.85: EPAD 0,0
SOT23-5 = smd 0.4 x 0.6: IN+ 0.95,1.1; IN- 0.95,-1.1; OUT -0.95,1.1; VCC+ -0.95,-1.1; VCC- 0,1.1
TSSOP14 = smd 0.9 x 0.35: 1 -2.875,1.95; 2 -2.875,1.3; 3 -2.875,0.65; 4 -2.875,0; 5 -2.875,-0.65; 6 -2.875,-1.3; 7 -2.875,-1.95; 8 2.875,-1.95; 9 2.875,-1.3; 10 2.875,-0.65; 11 2.875,0; 12 2.875,0.65; 13 2.875,1.3; 14 2.875,1.95
VFQPN = smd 0.63 x 0.3: 1 -1.39,0.75; 2 -1.39,0.25; 3 -1.39,-0.25; 4 -1.39,-0.75; 9 1.39,-0.75; 10 1.39,-0.25; 11 1.39,0.25; 12 1.39,0.75 | smd 0.3 x 0.63: 5 -0.75,-1.39; 6 -0.25,-1.39; 7 0.25,-1.39; 8 0.75,-1.39; 13 0.75,1.39; 14 0.25,1.39; 15 -0.25,1.39; 16 -0.75,1.39 | smd 1.85 x 1.85: EPAD 0,0
CRYSTAL_2.5X2 = smd 0.9 x 0.8: 1 -0.825,-0.625; 2 0.825,-0.625; 3 0.825,0.625; 4 -0.825,0.625

### Placement (x,y rotation side)
C101  10.9,25.8 270 top
C102  9.7,21.9 270 top
C103  19.4,17.7 90 top
C104  7.8,21.7 180 top
C105  7.8,25.9 0 top
C106  21.4,22.6 270 top
C201  30,22.4 180 top
C202  30,20.4 180 top
C203  30.3,24.2 180 top
C204  34.7,28.2 0 top
C205  30.2,30.6 180 top
C206  29.9,34.4 180 top
C207  29.9,32.4 180 top
C301  23.3,4.4 0 top
C302  23.3,5.9 0 top
C303  23.3,7.4 0 top
C304  19.3,12.3 90 top
C305  15.8,28 90 top
C306  16.1,9.7 90 top
C307  11,8.6 90 top
C308  11.6,10.1 0 top
C309  11.9,11.4 180 top
C310  5.25,4.93 180 top
C401  18.3,38.9 180 top
C402  18.3,37.4 180 top
C403  18.3,40.4 180 top
C404  18.6,31.5 180 top
C405  16.1,31 90 top
C406  12.3,32.1 90 top
C407  12.3,34.1 270 top
C408  7.9,35.9 180 top
C409  7.5,31.4 270 top
C410  6.2,31.7 270 top
C411  9,31.8 180 top
D201  30,18.6 180 top
D202  30,36.2 180 top
H1  36.39,3.86 0 top
H2  3.81,41.21 0 top
J1  31.7,40.7 270 top
JP101  35.6,12.4 270 top
JP102  2.9,30.2 90 top
JP301  29.6,2.3 0 top
JP302  13.2,0.3 180 top
JP401  13.4,42.8 0 top
L201  27,27.4 90 top
LED+  12.1,37.3 270 top
LED-  14.7,37.3 90 top
LEDU  27.6,9.6 0 top
LEDV  29.6,9.6 0 top
LEDW  31.6,9.6 0 top
R101  9.4,28.8 0 top
R201  34.9,20.4 0 top
R202  32.3,23.3 270 top
R203  36.2,22.9 270 top
R204  36.2,24.8 90 top
R205  33.7,31.9 180 top
R206  34.7,30.5 180 top
R207  33.7,32.9 180 top
R208  35,18.6 0 top
R209  32.6,36.2 0 top
R301  19.3,14.2 90 top
R302  14.8,28 270 top
R303  20.8,5.1 270 top
R304  18.8,5.1 270 top
R305  27.6,6.6 270 top
R306  29.6,6.6 270 top
R307  31.6,6.6 270 top
R308  14.6,7.1 180 top
R309  16.1,7.8 90 top
R310  17.6,8.6 270 top
R311  19.6,8.6 270 top
R312  12.5,7.1 0 top
R313  12,8.6 270 top
R314  15.1,11.8 270 top
R315  4.4,13.2 270 top
R401  20.3,29.8 270 top
R402  17.1,31 270 top
R403  22.8,40.8 90 top
R404  20.8,40.8 90 top
R405  21.4,31.8 270 top
R406  22.4,31.8 270 top
R407  13.8,32.6 180 top
R408  13.8,31.6 180 top
R409  14.3,34.1 270 top
R410  13.3,34.1 90 top
R411  12.1,39.6 90 top
R412  14.7,39.6 270 top
R413  10.5,34.4 270 top
R414  9.8,35.9 180 top
R415  9,37.4 180 top
R416  9,39.4 180 top
R417  10.5,32.3 90 top
R418  9,30.8 0 top
R419  5.9,34.9 0 top
TP1  6.6,27.9 0 top
TP2  12.4,13.2 90 top
TP3  21.4,14.7 0 top
TP4  21.4,16.7 0 top
TP5  23.4,16.7 0 top
TP6  25.4,16.7 0 top
TP7  23.4,14.7 0 top
TP8  25.4,14.7 0 top
TP9  17.4,13.7 0 top
TP10  18.7,29.9 0 top
TP101  11.4,28.8 0 top
TP102  25.2,19.6 90 top
TP201  34.7,22.9 270 top
TP202  34.7,24.8 270 top
TP203  34.7,26.7 90 top
TP204  32.7,30.4 270 top
TP205  32.7,34.5 270 top
U100  15.13,21.77 0 top
U101  23.9,22.5 270 top
U200  31.7,27.4 180 top
U300  23.4,10.7 0 top
U301  14,9.2 270 top
U302  4.4,8.8 270 top
U400  18.4,33.8 180 top
U401  8.4,33.8 0 top
X101  7.8,23.8 270 top

### Tracks (layer width: path | path; a pad name or v marks a point on that pad's centre or on a via)
3.3V  (via drill 0.25)
  Top 0.2: TP205.1 33.1,34.9 R209.2
  Top 0.254: v14.2,35.4 14.3,35.3 R409.1 | v23.6,22.2 23.57,22.18 U101.3 21.48,22.18 C106.2 | U100.17 19.4,18.96 C103.2 v20.2,18.2 | U100.1 arc90 10.9,24.59 C101.2 v10.1,25.3 | R315.1 v4.4,14.4 | R301.2 v18.5,14.7 | R413.2 v11.3,33.9 | R308.2 v14.1,6.3 | R401.2 v20.3,28.5 | v33.6,33.8 33.2,33.4 R207.2 32.7,32.9 v32.3,32.5 | U100.5 9.72,21.38 C102.2 9.2,21.4 v8.9,21.1
  Top 0.305: U401.VCC+ 7.45,31.95 C409.1 | U401.VCC+ 6.4,32.7 C410.1 | v8.5,33.4 9,33.9 R413.2 | v7.4,33.4 7.45,33.35 U401.VCC+ | C309.1 12.9,11.2 U301.VCC+ | U301.VCC+ 13.55,10.15 v13.6,10.2 | R308.2 14.1,8.6 v13.6,9.1 | U301.VCC+ 12.15,10.15 C308.2
  Top 0.406: R207.2 R205.2 31.3,31.9 C207.1
  Top 0.508: C206.1 30.9,34.5
  Top 1.016: 30.9,34.5 TP205.1
  Bottom 0.305: v8.5,33.4 v7.4,33.4 | v13.6,10.2 v13.6,9.1
  other vias: 13.6,10.9 13.6,11.6 4.7,4.2 4,4.9 18.4,3.1 19.2,3.1 18.8,2.6 18.4,2.1 19.2,2.1 20.4,43.8 21.2,43.8 20.8,43.3 21.2,42.8 20.4,42.8 5.9,33.4 6.5,33.4
  pour Top (no thermals): 31.5,28.5 31.5,35 31.3,35.2 30.4,35.2 30.2,35 30.2,30.5 30.9,29.8 30.9,28.5
  pour Top (no thermals): 12.3,11.8 13.1,11.8 13.4,11.8 13.5,11.9 13.8,11.9 14,11.7 14,10.8 13.8,10.6 13.5,10.6 13.3,10.8 13.3,10.9 12.5,10.9 12.3,11.1 12.3,11.2 12.3,11.7
  pour Top (no thermals): 4.2,6.4 4.2,5.5 4,5.3 3.9,5.3 3.6,5 3.6,4.8 4.6,3.8 4.9,3.8 5.1,4 5.1,5.1 5.1,5.3 5.3,5.5 5.3,6.4
  pour Top (no thermals): 20.1,41.2 20.1,43.9 20.3,44.1 21.2,44.1 21.3,44.1 21.5,43.9 21.5,41.2
  pour Top (no thermals): 18.1,4.7 18.1,2 18.3,1.8 19.3,1.8 19.5,2 19.5,4.7
  pour Route15 (rank 6): 0,0 19.6,0 19.6,3.4 20.1,3.9 25,3.9 25.6,4.5 25.6,5.4 27.7,7.5 33.6,7.5 33.6,16.8 36,19.2 36,21.4 37.2,22.6 37.2,41.3 35.5,43 24.4,43 23.6,42.2 23.5,42.1 22.2,42.1 21.7,42.6 21.7,45 0.1,45 0,45 0,0.1
  pour Top (no thermals): 5.8,32.2 5.8,33.1 5.7,33.2 5.7,33.6 5.8,33.7 6.6,33.7 6.8,33.5 6.8,33.3 6.6,33.1 6.6,32.2
BOOT
  Top 0.254: U100.31 13.13,28.07 12.4,28.8 TP101.1 R101.2
CAN_H
  Top 0.254: U101.7 26.27,22.82 27.4,21.7 27.4,18.3 28.5,17.2 32.2,17.2 33.5,15.9 33.5,14.8 34.63,13.67 JP101.2
CAN_L
  Top 0.254: U101.6 26.12,22.18 27.02,21.28 27.02,18.14 28.34,16.82 32.04,16.82 33.12,15.74 33.12,14.64 33.8,13.96 33.8,12.2 34.87,11.13 JP101.3
CAN_RX
  Top 0.254: U100.21 20.35,22.18 20.98,21.55 22.58,21.55 U101.4
CAN_SHDN
  Top 0.254: U101.5 TP102.1
CAN_TX
  Top 0.254: U100.22 20.3,22.98 20.98,23.65 21.82,23.65 22,23.48 U101.1
CRYSTALIN
  Top 0.254: C105.1 7.17,25.77 X101.1 arc-90 7.2,24.6 7.2,24.1 arc90 7.53,23.77 U100.2
CRYSTALOUT
  Top 0.254: C104.1 8.43,21.73 X101.3 U100.3
GND  (via drill 0.25)  (3 unrouted)
  Top 0.254: v23.6,22.8 23.57,22.82 U101.2 21.98,22.82 21.7,23.1 C106.1 | U300.7 23.65,8.55 24.1,8.1 C303.2 | C105.2 8.3,24.75 X101.4 | C104.2 7.3,22.85 X101.2
  other vias: 29.8,27.4 29.2,28.6 29.4,26.9 29.4,27.9 29,27.4 29.2,26.2 36,27.8 36,28.6 35.3,29 34.3,29 35.3,29.7 34.7,29.7 36,30.2 36,30.9 35.4,31.3 34.8,31.3 33.3,28.7 32.1,28 37,24.3 37,23.4 28.5,24.2 28,22.9 28,22.3 28,21.7 28,21 28,20.4 28,19.8 28.1,18.6 28.4,30.6 27.9,32.4 27.9,31.8 27.9,33 27.9,34.4 27.9,33.8 27.9,35 28,36.2 6.5,29.9 5.9,29.9 7.5,30.2 11.3,32.8 7,36.8 7,37.6 7,39.2 7,40 7,38.4 8.5,34.2 10.1,11.1 10.1,11.7 10.4,10.1 13,6.3 17,10.6 17.8,10.6 19.4,10.6 20.2,10.6 18.6,10.6 14.4,9.1 12.3,35.4 13.3,35.4 12.8,36.5 13.9,36.5 16.6,40.6 16.6,39.4 16.6,38.4 16.6,37.3 8.1,28.8 11.7,26.3 18.6,17.2 27.6,11.2 29.6,11.2 31.5,11.2 8.4,26.7 9,25.6 9.4,24.6 6.6,22 6.2,22.9 9,21.9 12.3,27 10.8,27.1 6.5,4.9 5.8,4.2 25,7.5 25,6.7 25,5.9 25,5.1 25,4.3 3.6,12.5 4,10.8 5.7,6.8 28.6,9.7 30.6,9.7 18.6,11.7 20.2,11.7 11.5,31.6 12.4,30.8 13.3,30.8 19.9,32.3 19.9,31.6 20.5,31.2 20.5,31.9 6.7,35.9 15,34.1 15.9,32.3 6.9,34.1 9.7,20 16.8,24.9 20.7,22.6 22,18 23.9,17.5 21.3,12.1 23.5,8.6 14.4,11.7 14.1,19.9 13.4,19.1 13.4,39.3 13.4,41.3 17.9,36.1 17.5,22.1 16.5,19.8 28,15 31,15 28,12 31,12 33.5,17.5 23,20 27,24 19,27 6,15 6,18 3,18 3,15 9,18 3,9 6,9 9,6 9,3 6,2 3,3 24,2 22,38 25,38 25,35 22,35 10,43 7,43 5,38 1.2,39.9 4.5,32.8 4.5,27.7 9,11.5 10.9,13.9 13.9,14.9 15.4,13.3 16.9,11.7 16.8,6.1 14.4,1.3 33.9,6.5 34.4,1.1 38.5,1.3 38.7,6.7 38.6,12.3 38.6,18.3 38.6,28.1 38,34 35,34 35,37 38,37 38,40 38,43 25,41 22,27 13,24 12.4,21.2 32.2,33.4 32.5,19.3 32.5,21.7 33.7,24.1 33.8,25.8 36.5,26.3
  pour Bottom (rank 6): 0,45 40,45 40,0 0,0
  pour Route2 (rank 6): 0,45 40,45 40,0 0,0
  pour Top (rank 6): 0,45 40,45 40,0 0,0
  pour Top (no thermals): 21.7,23.3 21.1,23.3 20.5,22.7 20.5,22.5 20.6,22.4 20.8,22.4 20.9,22.5 20.9,22.8 21,22.9 21.7,22.9
N$1
  Top 0.254: U302.4 R315.2
N$2
  Top 0.254: R407.2 C406.2
N$3
  Top 0.254: U400.2 21.65,33.55 22.4,32.8 R406.1
N$4
  Top 0.254: U302.7 2.45,11.05 3.88,9.62 7.94,9.62 9.12,8.44 9.12,7.84 11.93,5.03 JP302.2
N$5
  Top 0.254: U400.1 21.15,33.05 21.4,32.8 R405.1
N$6
  Top 0.254: R305.1 LEDU.A
N$10
  Top 0.254: R306.1 LEDV.A
N$11
  Top 0.254: R307.1 LEDW.A
N$12
  Top 0.254: U300.6 23.15,8.95 22.5,8.3 C303.1
  Top 0.406: C301.1 C302.1 C303.1
  Top 0.508: C302.1 20.9,5.9 R303.1
  Top 0.61: R304.1 R303.1
N$13
  Top 0.254: U302.6 3.1,11 4.1,10 8.1,10 9.5,8.6 9.5,8 11.6,5.9 12.72,5.9 14.47,4.15 JP302.1
N$14
  Top 0.305: C307.1 R313.2 | R313.2 12.15,8.25 U301.IN- | R313.2 R312.1
N$15
  Top 0.305: C408.1 R414.2 9.35,35.85 U401.IN+ R413.1
N$16
  Top 0.305: R308.1 U301.IN+ 16.05,8.25 R309.2 C306.1
N$17
  Top 0.305: U401.IN- 9.35,31.95 C411.1 | C411.1 R418.2 | C411.1 R417.1
N$19
  Top 0.254: U400.12 15.35,33.05 14.9,32.6 R407.1 R408.1
N$20  (1 unrouted)
  Top 0.254: U400.6 18.65,35.95 19.1,36.4 C402.1
  Top 0.406: C402.1 C401.1 19.1,40 | 19.1,40 C403.1 | R404.1 19.2,39.9 19.1,40
N$22
  Top 0.254: LED+.A 11.35,37.95 R411.1
N$23
  Top 0.254: LED-.A 15.45,37.95 R412.2
N$25
  Top 0.254: C407.2 R410.1 R409.2 16.4,33.6 16.45,33.55 U400.11
N$27
  Top 0.305: R418.1 C411.2 8.5,32.3 7.93,32.87 7.93,33.97 7.45,34.45 U401.OUT R419.2
N$29
  Top 0.305: C307.2 R313.1 12.88,9.1 13.39,9.61 14.11,9.61 14.65,10.15 U301.OUT R314.2
N$270
  Top 0.254: R208.1 D201.A
N$271
  Top 0.2: R209.1 D202.A
NRESET
  Top 0.254: U100.4 15.68,22.18 18.8,25.3 22.96,25.3 23.84,26.18 23.84,30.12 26.64,32.92 26.64,36.62 29.16,39.14 J1.!RESET
OUT1  (via drill 0.25)
  Top 0.254: U400.10 15.95,34.05 v15.7,34.3 | U400.3 20.55,34.05 v20.6,34.1 | R411.2 12.1,42.77 JP401.1
  Bottom 0.254: v20.6,34.1 15.9,34.1 v15.7,34.3 14.7,35.3 14.7,39.1 12.13,41.67 JP401.1
OUT2  (via drill 0.25)
  Top 0.254: R412.1 14.7,42.77 JP401.2 | U400.5 19.89,35.19 v20.2,35.5 | v16.8,35.5 17.11,35.19 U400.8
  Bottom 0.254: v20.2,35.5 v16.8,35.5 16,36.3 16,41.47 JP401.2
PA0/CURR_FDB_MAG
  Top 0.254: R419.1 5.4,29.1 | 5.4,29.1 5.4,22.3 7.1,20.6 10.86,20.6 U100.6 | TP1.1 5.4,29.1
PA1/CURR_FDB_BLDC  (via drill 0.25)
  Top 0.254: R314.1 13.3,12.3 TP2.1 | U100.7 11.93,19.77 12.4,19.3 v12.4,18.7
  Bottom 0.254: v12.4,18.7 TP2.1
PA2/USART2_TX
  Top 0.254: U100.8 9.82,18.98 8.58,20.22 6.94,20.22 5,22.16 5,24.29 JP102.P$2
PA3/USART2_RX
  Top 0.254: JP102.P$3 2.9,28.08 1.71,26.88 1.71,25.9 2.41,25.2 3.43,25.2 4.62,24 4.62,22 6.78,19.84 8.42,19.84 9.79,18.47 10.83,18.47 11.78,17.52 U100.9
PA4/FAULT_BLDC  (via drill 0.25)
  Top 0.254: U300.13 24.15,12.57 24.18,12.6 24.18,13.32 v24.1,13.4 | v13.1,16.5 13.1,17.49 U100.10 | R302.1 v14.8,29.3
  Top 0.305: R302.1 C305.2
  Bottom 0.254: v24.1,13.4 23.61,13.89 21.07,13.89 19.7,15.26 16.06,15.26 14.82,16.5 v13.1,16.5 14.22,17.62 14.22,18.7 14.8,19.28 v14.8,29.3
PA5/SPI1_SCK
  Top 0.254: U302.2 5.7,12.7 8.7,15.7 13.1,15.7 13.93,16.53 U100.11
PA6/CAN_LSTN  (via drill 0.25)
  Top 0.254: U100.12 14.73,18.47 v14.7,18.5 | U101.8 23.68,23.48 v23.6,23.4
  Bottom 0.254: v14.7,18.5 19.78,18.5 22.78,21.5 22.78,22.68 23.6,23.5 v23.6,23.4
PA7/INUL  (via drill 0.25)
  Top 0.254: U300.1 22.01,14.09 TP3.1 | v15.5,16.5 15.5,17.49 U100.13
  Bottom 0.254: TP3.1 20.97,15.13 20.75,15.13 20.25,15.64 16.36,15.64 v15.5,16.5
PA8/INUH/PWM_MAG  (via drill 0.25)
  Top 0.254: U300.2 21.69,10.95 20.59,12.04 20.59,15.83 21.4,16.64 TP4.1 21.4,18.8 v20.4,19.8 19.41,19.8 U100.18 | v22.4,30.5 R406.2
  Bottom 0.254: v20.4,19.8 22.4,21.8 v22.4,30.5
PA9/INVH/DIR_MAG  (via drill 0.25)
  Top 0.254: U300.16 22.65,14.31 22.59,14.37 22.59,15.89 TP5.1 23.4,17.55 20.38,20.57 | U100.19 20.38,20.57 | 20.38,20.57 v20.4,20.6 | v21.4,30.5 R405.2
  Bottom 0.254: v20.4,20.6 21.4,21.6 v21.4,30.5
PA10/INWH
  Top 0.254: U300.12 24.79,14.17 24.59,14.37 24.59,15.89 TP6.1 20.93,21.16 20.82,21.16 20.61,21.38 U100.20
PA15/SPI1_NSS  (via drill 0.25)
  Top 0.254: U302.1 6.38,11.7 v7.1,11.7 | v14.3,23.5 15.1,24.3 17.26,24.3 17.93,24.97 U100.25
  Bottom 0.254: v7.1,11.7 11.92,16.52 11.92,18.9 14.3,21.28 v14.3,23.5
PB0/INVL  (via drill 0.25)
  Top 0.254: U300.15 23.15,14.45 TP7.1 | v16.3,16.5 16.3,17.49 U100.14
  Bottom 0.254: TP7.1 22.59,15.51 20.91,15.51 20.4,16.02 16.9,16.02 16.42,16.5 v16.3,16.5
PB1/INWL  (via drill 0.25)
  Top 0.254: U300.11 25.11,10.95 25.4,11.24 TP8.1 | U100.15 17.2,17.46 17.1,17.36 v17.1,16.5
  Bottom 0.254: TP8.1 24.21,15.89 21.07,15.89 20.46,16.5 v17.1,16.5
PB3/EN_MAG
  Top 0.254: R402.2 17.1,26.06 U100.26
PB4/SPI1_MISO  (via drill 0.25)
  Top 0.254: U302.3 5.05,12.75 v5.3,13 | v14.3,24.2 14.78,24.68 15.8,24.68 16.33,25.21 U100.27
  Bottom 0.254: v5.3,13 7.86,13 11.54,16.68 11.54,19.06 13.8,21.32 13.8,23.7 v14.3,24.2
PB6/EN_BLDC
  Top 0.254: U100.29 14.73,27.43 R302.2
PB7/FAULT_MAG
  Top 0.254: U400.13 17.21,32.41 17.1,32.3 R402.1 C405.2 15.5,31.5 13.9,29.9 13.9,26.06 U100.30
SENSE_BLDC  (via drill 0.25)
  Top 0.254: U300.9 v24.8,9.3 | v22,9.3 v22.01,9.31 U300.4 21.45,9.95 20.9,9.4 20.9,8.1 20.5,7.7 R311.2
  Top 0.305: R309.1 17.2,7.3 R310.2
  Top 0.61: R310.2 R311.2
  Bottom 0.254: v24.8,9.3 v22,9.3
SENSE_MAG  (via drill 0.25)
  Top 0.254: U400.4 20.35,34.55 v20.6,34.8 | U400.9 16.45,34.55 v16.2,34.8 15.1,35.9 R414.1
  Top 0.305: R414.1 10.3,37 R415.1
  Top 0.61: R415.1 R416.1
  Bottom 0.254: v20.6,34.8 v16.2,34.8
STBY/RESET_BLDC  (via drill 0.25)
  Top 0.254: U300.14 23.65,12.75 v23.7,12.8 | v20.1,12.9 19.5,12.9 C304.2 | C304.2 R301.1 | C304.2 17.4,12.8 TP9.TP
  Bottom 0.254: v23.7,12.8 20.2,12.8 v20.1,12.9
STBY/RESET_MAG
  Top 0.254: U400.14 18.15,31.55 C404.2 18.1,30.5 TP10.TP 19.1,29.9 19.5,30.3 R401.1
SWCLK
  Top 0.254: J1.SWDCLK 32.9,39.99 32.9,38.3 32.48,37.88 28.44,37.88 27.02,36.46 27.02,32.76 24.22,29.96 24.22,26.02 22.78,24.58 20.64,24.58 20.64,24.57 U100.24
SWDIO
  Top 0.254: U100.23 20.38,23.77 20.8,24.2 23,24.2 24.6,25.8 24.6,29.8 27.4,32.6 27.4,36.3 28.6,37.5 33.4,37.5 34.2,38.3 34.2,40.02 J1.SWDIO
TPS-EN
  Top 0.254: U200.1 32.3,26.65 31.93,26.27 U200.14 31.93,24.77 32.3,24.4 R202.1 32.9,23.8 33.8,22.9 TP201.1 35.2,22.4 R203.2
TPS-FB
  Top 0.254: U200.5 32.42,29.12 32.6,29.3 33.7,29.3 34.2,29.8 R206.2
  Top 0.406: R206.2 R205.1
TPS-FB2
  Top 0.254: U200.6 31.93,29.62 TP204.1
TPS-L1  (via drill 0.25)
  Bottom 1.016: v30.1,26.4 v30.1,25.2 v25.8,25.2
  other vias: 26.6,25.2 27.4,25.2 28.2,25.2 30.1,25.8
  pour Top (no thermals): 25.4,26.6 25.4,24.7 28.6,24.7 28.6,26.6
  pour Top (no thermals): 31.6,27 30.3,27 29.8,26.5 29.8,25.1 30,24.9 30.4,24.9 30.6,25.1 30.6,26.4 30.8,26.6 31.4,26.6 31.6,26.8
TPS-L2  (via drill 0.25)
  Bottom 1.016: v30.1,28.4 v30.1,29.6 v25.8,29.6
  other vias: 27.4,29.6 26.6,29.6 28.2,29.6 30.1,29
  pour Top (no thermals): 28.6,28.2 28.6,30.1 25.4,30.1 25.4,28.2
  pour Top (no thermals): 31.6,27.8 30.3,27.8 29.8,28.3 29.8,29.7 30,29.9 30.4,29.9 30.6,29.7 30.6,28.3 30.7,28.2 31.4,28.2 31.6,28
TPS-PG
  Top 0.254: U200.2 33.25,27.15 33.7,26.7 TP203.1 35.7,26.7 36.6,27.6 36.6,32 35.7,32.9 R207.1
TPS-VAUX
  Top 0.254: U200.3 33.25,27.65 33.8,28.2 C204.1
TPS-VIN
  Top 0.508: R202.2 31.3,22.8 C201.1
  Top 1.016: C202.1 R201.1
  pour Top (no thermals): 31.6,26.3 31.6,24.7 31.5,24.6 31.5,19.9 31.3,19.7 30.5,19.7 30.3,19.9 30.3,24.2 30.9,24.8 30.9,26.3
TPS-VSEL
  Top 0.254: U200.15 32.42,25.77 33.4,24.8 TP202.1 35.2,25.3 R204.2
U  (via drill 0.25)
  Top 0.254: U300.3 21.25,10.45 v21.2,10.5 | R305.2 27.6,2.84 JP301.1
  Bottom 0.254: v21.2,10.5 21.2,9.2 22.3,8.1 26.1,8.1 27.06,7.14 JP301.1
V  (via drill 0.25)
  Top 0.254: U300.8 24.15,8.95 v24.5,8.6 | R306.2 JP301.2
  Bottom 0.254: v24.5,8.6 29.1,8.6 29.6,8.1 JP301.2
V_BATT  (via drill 0.25)
  Top 0.254: R201.2 35.5,20.1 R208.2
  other vias: 20.4,3.1 20.8,2.6 21.2,3.1 20.4,2.1 21.2,2.1 22.4,42.8 23.2,42.8 22.8,43.3 22.4,43.8 23.2,43.8 36.8,21 36.8,20.4 36.8,19.8 37.4,20.1 37.4,20.7
  pour Top (no thermals): 20.1,4.7 20.1,2 20.3,1.8 21.3,1.8 21.5,2 21.5,4.7
  pour Top (no thermals): 22.1,41.2 22.1,43.9 22.3,44.1 23.3,44.1 23.5,43.9 23.5,41.2
  pour Route15 (rank 6): 40,45 22,45 22,42.7 22.3,42.4 23.4,42.4 24.3,43.3 35.6,43.3 37.5,41.4 37.5,22.5 36.3,21.3 36.3,19.1 33.9,16.7 33.9,7.2 27.8,7.2 25.9,5.3 25.9,4.4 25.1,3.6 20.2,3.6 19.9,3.3 19.9,0 40,0
  pour Top (no thermals): 35.3,21 35.4,21.1 36.3,21.1 36.6,21.4 37,21.4 37.3,21.1 37.6,21.1 37.8,20.9 37.8,20 37.8,19.9 37.6,19.7 37.3,19.7 37,19.4 36.6,19.4 36.3,19.7 35.4,19.7 35.3,19.8
W  (via drill 0.25)
  Top 0.254: U300.10 25.45,10.45 v25.5,10.5 | R307.2 31.6,2.84 JP301.3
  Bottom 0.254: v25.5,10.5 31,10.5 32.14,9.36 JP301.3